# Altium schematic sheet USB-to-UART. Page 6.SchDoc
size 420 x 297 mm; Address1: Address1; Address2: Address2; Address3: Address3; Address4: Address4; DocumentNumber: АБВГ.123456.001 Э3; SheetNumber: 6; SheetTotal: 7; Scale: 1:1; DocumentType: Схема электрическая принципиальная; FirstReferrence: АБВГ.123456.001
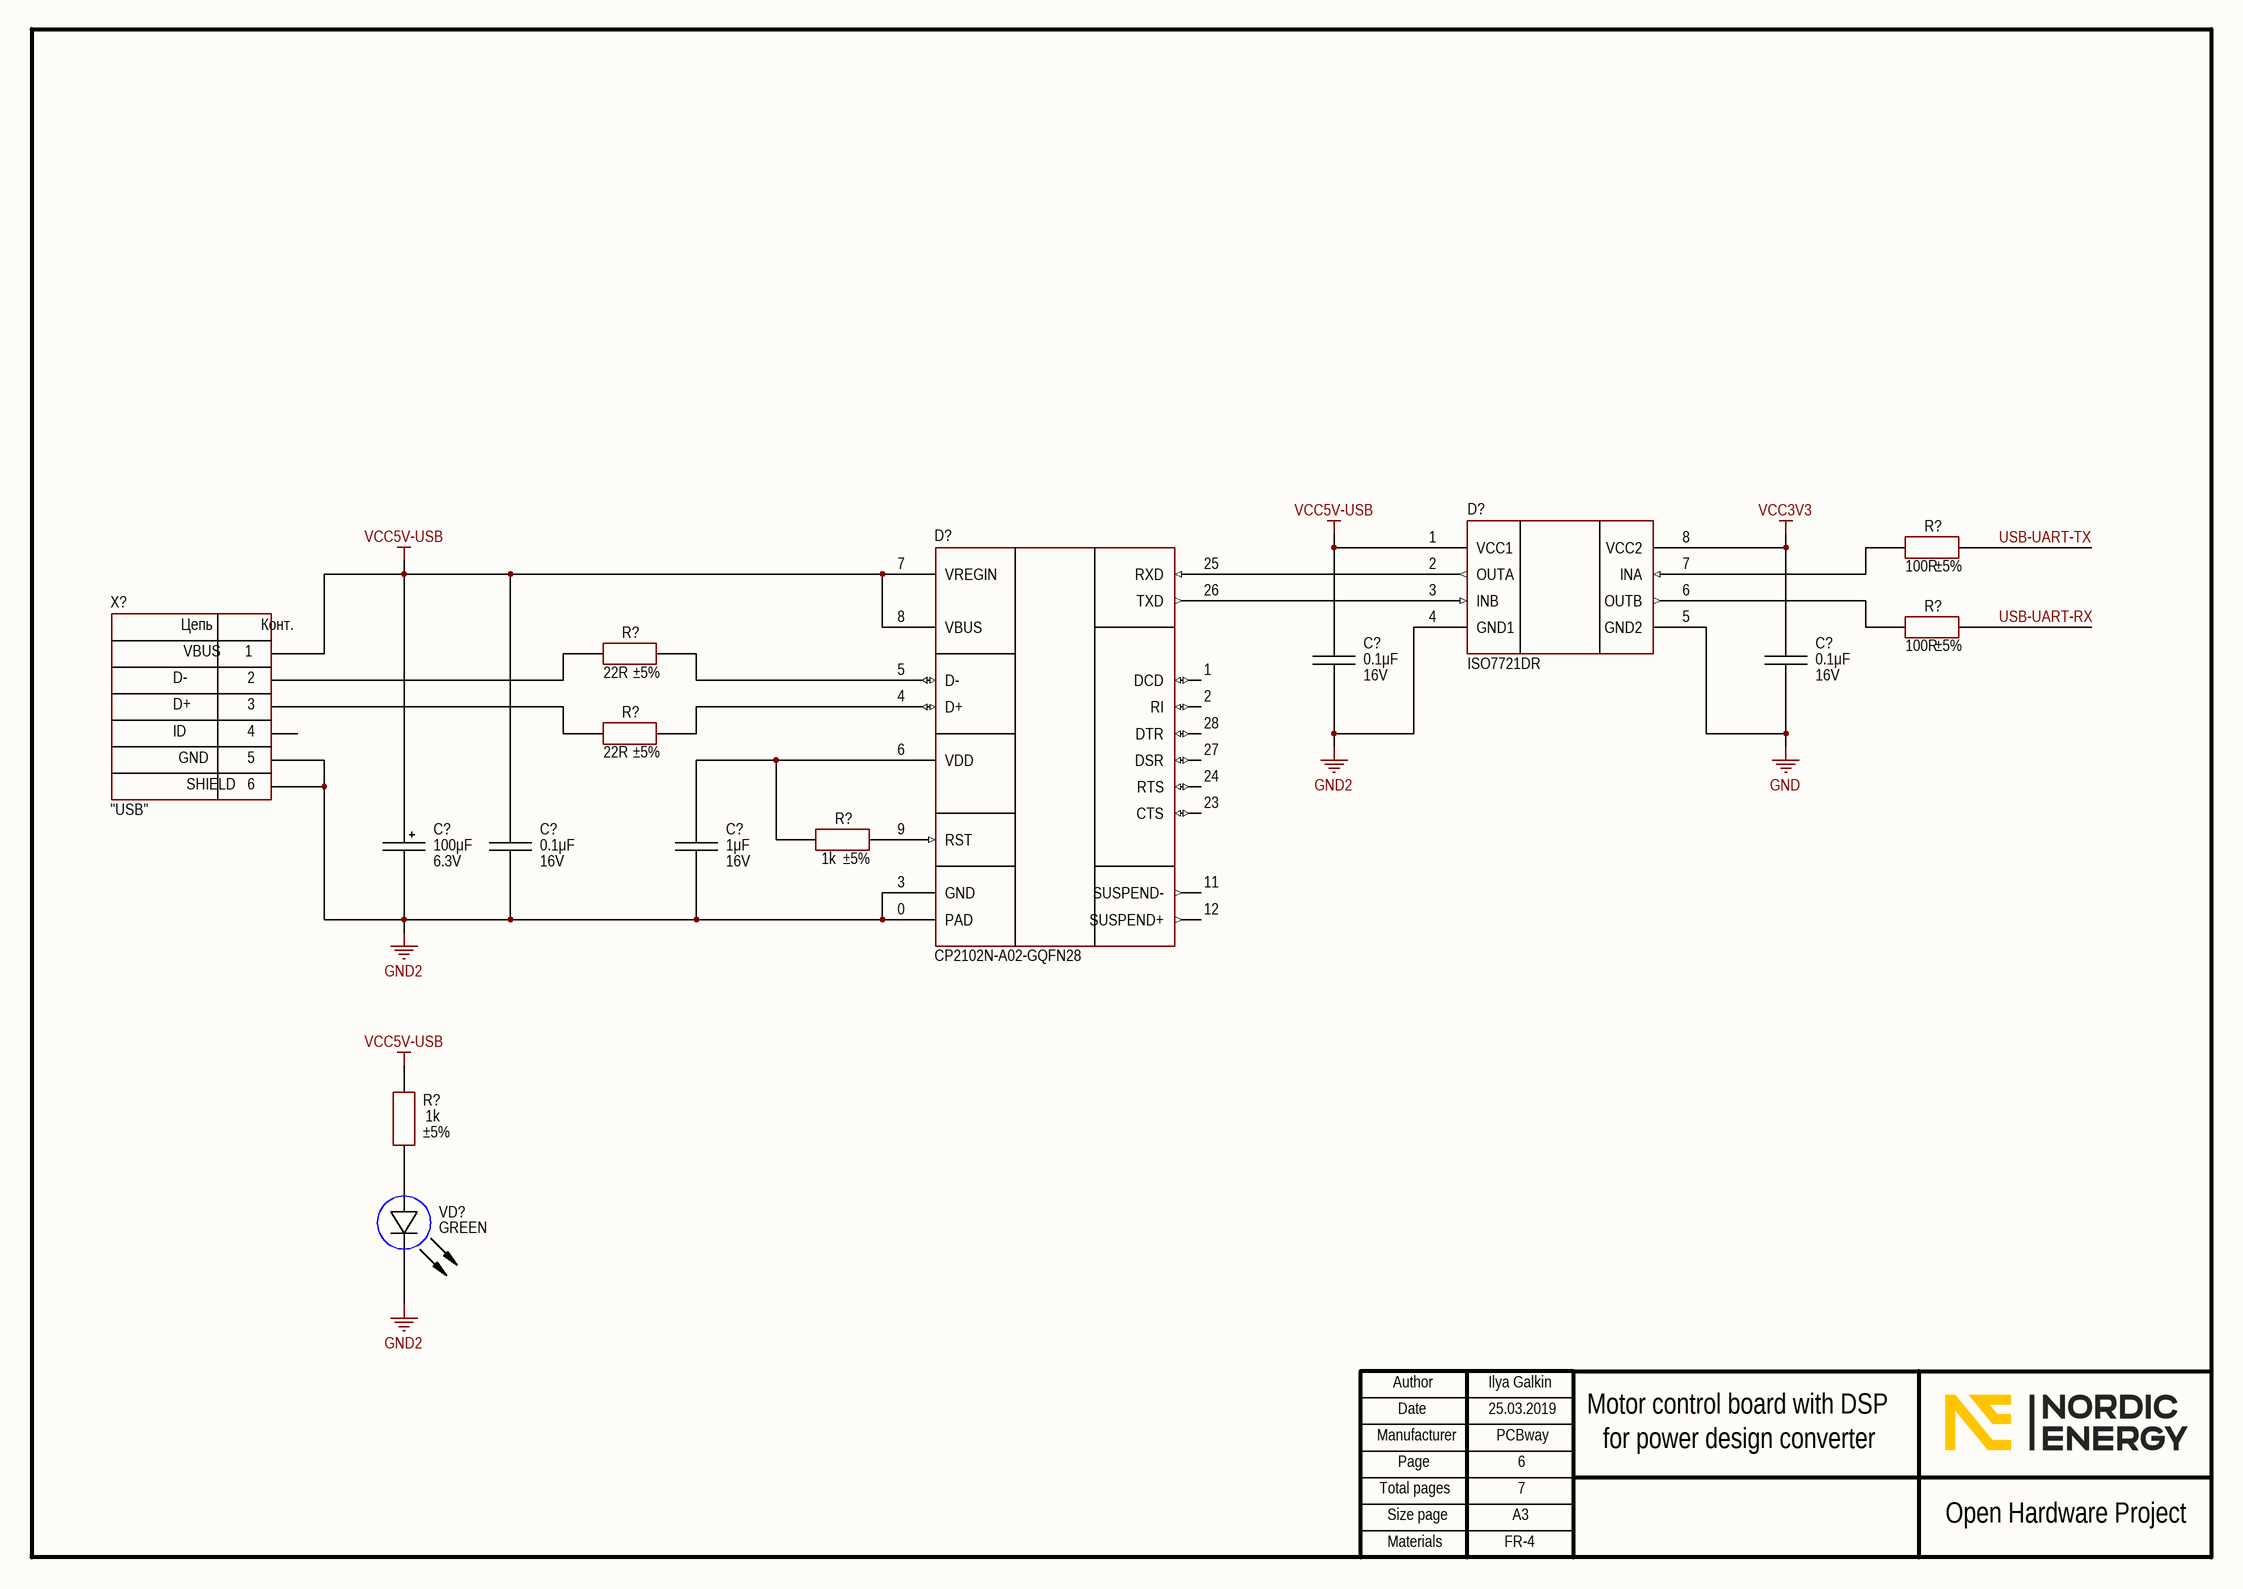
[diagram p0: USB-to-UART. Page 6.SchDoc]

## Parts
(Parts that share a designator on the sheet are numbered #1, #2 ... from top to bottom, then left to right.)
C?#1  value 0.1μF  Voltage: 16V  [CAP: 0805]
C?#2  value 0.1μF  Voltage: 16V  [CAP: 0805]
C?#3  value 100μF  Voltage: 6.3V  [CAP: TANTAL-A]
C?#4  value 0.1μF  Voltage: 16V  [CAP: 0805]
C?#5  value 1μF  Voltage: 16V  [CAP: 0805]
D?#1  (no value)  [8-SOIC]
D?#2  PartNumber: CP2102N-A02-GQFN28  [28-QFN (5x5)]
R?#1  value 100R  Tolerance: ±5%  [RES: 0805]
R?#2  value 100R  Tolerance: ±5%  [RES: 0805]
R?#3  value 22R  Tolerance: ±5%  [RES: 0805]
R?#4  value 22R  Tolerance: ±5%  [RES: 0805]
R?#5  value 1k  Tolerance: ±5%  [RES: 0805]
R?#6  value 1k  Tolerance: ±5%  [RES: 0805]
VD?  Color: GREEN  [LED: 0603G]
X?  CommentText: "USB"  [CON: USB micro-A (ZX62-B-5PA)]

## Nets
GND: C?#2.1 D?#1.5(GND2)
GND2: C?#1.1 C?#3.2 C?#4.1 C?#5.1 D?#1.4(GND1) D?#2.0(PAD) D?#2.3(GND) VD?.2(C) X?.0 X?.5
VCC3V3: C?#2.2 D?#1.8(VCC2)
VCC5V-USB: C?#1.2 C?#3.1 C?#4.2 D?#1.1(VCC1) D?#2.7(VREGIN) D?#2.8(VBUS) R?#6.2 X?.1
USB-UART-RX: R?#2.2
USB-UART-TX: R?#1.2
NetC?#5_2: C?#5.2 D?#2.6(VDD) R?#5.2
NetD?#1_2: D?#1.2(OUTA) D?#2.25(RXD)
NetD?#1_3: D?#1.3(INB) D?#2.26(TXD)
NetD?#1_6: D?#1.6(OUTB) R?#2.1
NetD?#1_7: D?#1.7(INA) R?#1.1
NetD?#2_4: D?#2.4(D+) R?#4.2
NetD?#2_5: D?#2.5(D-) R?#3.2
NetD?#2_9: D?#2.9(RST) R?#5.1
NetR?#3_1: R?#3.1 X?.2
NetR?#4_1: R?#4.1 X?.3
NetR?#6_1: R?#6.1 VD?.1(A)

Not connected (* = marked no-connect by the designer): D?#2 1(DCD) 2(RI) 11(SUSPEND-) 12(SUSPEND+) 23(CTS) 24(RTS) 27(DSR) 28(DTR); X? 4

## Notes on the sheet
- Ilya Galkin
- 25.03.2019
- PCBway
- 6
- Motor control board with DSP
- for power design converter
- 7
- FR-4
- Author
- Manufacturer
- Date
- Page
- Total pages
- Size page
- A3
- Open Hardware Project
- Materials
- (in symbol Connector_USB_micro_B) Цепь; Конт.; VBUS; D-; D+; ID; GND; SHIELD; 6

## Library data of the parts
C?#1 C?#2 C?#4 = Ceramic_0805: Manufacturer: Yageo; PartNumber: CC0805KRX7R7BB104; ValueManufacturerPartNumber: Ceramic capacitor, 0.1μF, X7R, ±10%, 16V, 0805, -55...+125°C; TypeCapacitor: Ceramic capacitor; Tolerance: ±10%; TypeDielectric: X7R; Package: 0805; HelpURL: https://www.digikey.com/product-detail/en/yageo/CC0805KRX7R7BB104/311-1142-1-ND/303052; Temperature: -55...+125°C
C?#3 = Tantal_A: Manufacturer: AVX; PartNumber: F930J107KAAAJ6; ValueManufacturerPartNumber: Tantalum capacitor, 100μF, 6.3V, ±10%, 2Ohm, case A (3216), -55...+125°C; Impedance: 2Ohm; Tolerance: ±10%; TypeDielectric: X7R; TypeCapacitor: Tantalum capacitor; Package: case A (3216); HelpURL: https://www.digikey.com/product-detail/en/avx-corporation/F930J107KAAAJ6/478-12404-1-ND/9645231; Temperature: -55...+125°C
C?#5 = Ceramic_0805: Manufacturer: Yageo; PartNumber: CC0805KKX7R7BB105; ValueManufacturerPartNumber: Ceramic capacitor, 1μF, X7R, ±10%, 16V, 0805, -55...+125°C; TypeCapacitor: Ceramic capacitor; Tolerance: ±10%; TypeDielectric: X7R; Package: 0805; HelpURL: https://www.digikey.com/product-detail/en/yageo/CC0805KKX7R7BB105/311-1365-1-ND/2103149; Temperature: -55...+125°C
D?#1 = ISO7721DR: Digital isolator; Manufacturer: Texas Instruments; ValueManufacturerPartNumber: IC digital isolator, 100Mbps, 3000Vrms, 2.25...5.5V, -55...+125°C, 8-SOIC; Supply: 2.25...5.5V; DataRate: 100Mbps; Isolation: 3000Vrms; HelpURL: https://www.digikey.com/product-detail/en/texas-instruments/ISO7721DR/296-48296-1-ND/8347715; Package: 8-SOIC; ComponentType: IC digital isolator; Temperature: -55...+125°C; PartNumber: ISO7721DR
D?#2 = CP2102N: USB-to-UART; Manufacturer: Silicon Labs; ValueManufacturerPartNumber: IC usb-to-uart bridge, USB2.0, 3...3.6V, -40...+85°C, 28-VFQFN; Supply: 3...3.6V; HelpURL: https://www.digikey.com/product-detail/en/silicon-labs/CP2102N-A02-GQFN28/336-5889-ND/9863477; Package: 28-VFQFN; ComponentType: IC usb-to-uart bridge; Temperature: -40...+85°C; Standard: USB2.0
R?#1 R?#2 = Resistor_0805: Manufacturer: Yageo; PartNumber: RC0805JR-07100RL; ValueManufacturerPartNumber: Resistor film, 100R, ±5%, 0805, 0.125W, -55...+125°C; TypeResistor: Resistor film; Power: 0.125W; Package: 0805; HelpURL: https://www.digikey.com/product-detail/en/yageo/RC0805JR-07100RL/311-100ARCT-ND/731185; Temperature: -55...+125°C
R?#3 R?#4 = Resistor_0805: Manufacturer: Yageo; PartNumber: RC0805JR-0722RL; ValueManufacturerPartNumber: Resistor film, 22R, ±5%, 0805, 0.125W, -55...+125°C; TypeResistor: Resistor film; Power: 0.125W; Package: 0805; HelpURL: https://www.digikey.com/product-detail/en/yageo/RC0805JR-0722RL/311-22ARCT-ND/731232; Temperature: -55...+125°C
R?#5 R?#6 = Resistor_0805: Manufacturer: Yageo; PartNumber: RC0805JR-071KL; ValueManufacturerPartNumber: Resistor film, 1k, ±5%, 0805, 0.125W, -55...+125°C; TypeResistor: Resistor film; Power: 0.125W; Package: 0805; HelpURL: https://www.digikey.com/product-detail/en/yageo/RC0805JR-071KL/311-1.0KARCT-ND/731165; Temperature: -55...+125°C
VD? = LED_single: Manufacturer: Wurth; ValueManufacturerPartNumber: LED, 20mA, 2V, 0805, -55...+150°C; PartNumber: 150080VS75000; TypeDiode: LED; Current: 20mA; VoltageDrop: 2V; Package: 0805; HelpURL: https://www.digikey.com/product-detail/en/wurth-electronics-inc/150080VS75000/732-4986-1-ND/4489922; Temperature: -55...+150°C
X? = Connector_USB_micro_B: Manufacturer: Hirose Electric; ValueManufacturerPartNumber: USB micro B; PartNumber: ZX62-B-5PA; HelpURL: https://www.digikey.com/product-detail/en/hirose-electric-co-ltd/ZX62-B-5PA/H11579CT-ND/1851090; TypeConnector: USB micro B